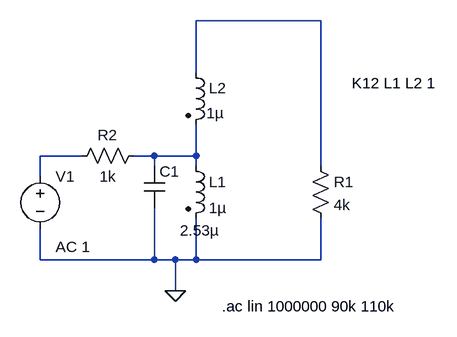
[diagram p0: schematic autotrafo1.asc]
autotrafo1.asc, the LTspice schematic file:
Version 4
SHEET 1 880 680
WIRE 368 -128 176 -128
WIRE 176 -48 176 -128
WIRE 0 80 -64 80
WIRE 112 80 80 80
WIRE 176 80 176 32
WIRE 176 80 112 80
WIRE 112 96 112 80
WIRE 176 96 176 80
WIRE 368 96 368 -128
WIRE -64 112 -64 80
WIRE -64 240 -64 192
WIRE 112 240 112 160
WIRE 112 240 -64 240
WIRE 144 240 112 240
WIRE 176 240 176 176
WIRE 176 240 144 240
WIRE 368 240 368 176
WIRE 368 240 176 240
WIRE 144 288 144 240
FLAG 144 288 0
SYMBOL ind2 160 80 R0
SYMATTR InstName L1
SYMATTR Value 1µ
SYMBOL ind2 160 -64 R0
WINDOW 3 32 78 Left 2
SYMATTR Value 1µ
SYMATTR InstName L2
SYMBOL res 352 80 R0
SYMATTR InstName R1
SYMATTR Value 4k
SYMBOL cap 96 96 R0
WINDOW 3 55 99 Left 2
SYMATTR Value 2.53µ
SYMATTR InstName C1
SYMBOL res 96 64 R90
WINDOW 0 0 56 VBottom 2
WINDOW 3 32 56 VTop 2
SYMATTR InstName R2
SYMATTR Value 1k
SYMBOL voltage -64 96 R0
WINDOW 123 24 124 Left 2
WINDOW 39 0 0 Left 2
SYMATTR Value2 AC 1
SYMATTR InstName V1
SYMATTR Value ""
TEXT 216 312 Left 2 !.ac lin 1000000 90k 110k
TEXT 416 -32 Left 2 !K12 L1 L2 1

The netlist it stands for:
* autotrafo1.asc
L1 N003 0 1µ
L2 N001 N003 1µ
R1 N001 0 4k
C1 N003 0 2.53µ
R2 N003 N002 1k
V1 N002 0 AC 1
.ac lin 1000000 90k 110k
K12 L1 L2 1
.backanno
.end